# EAGLE schematic gforce2 (EAGLE 7.1.0)
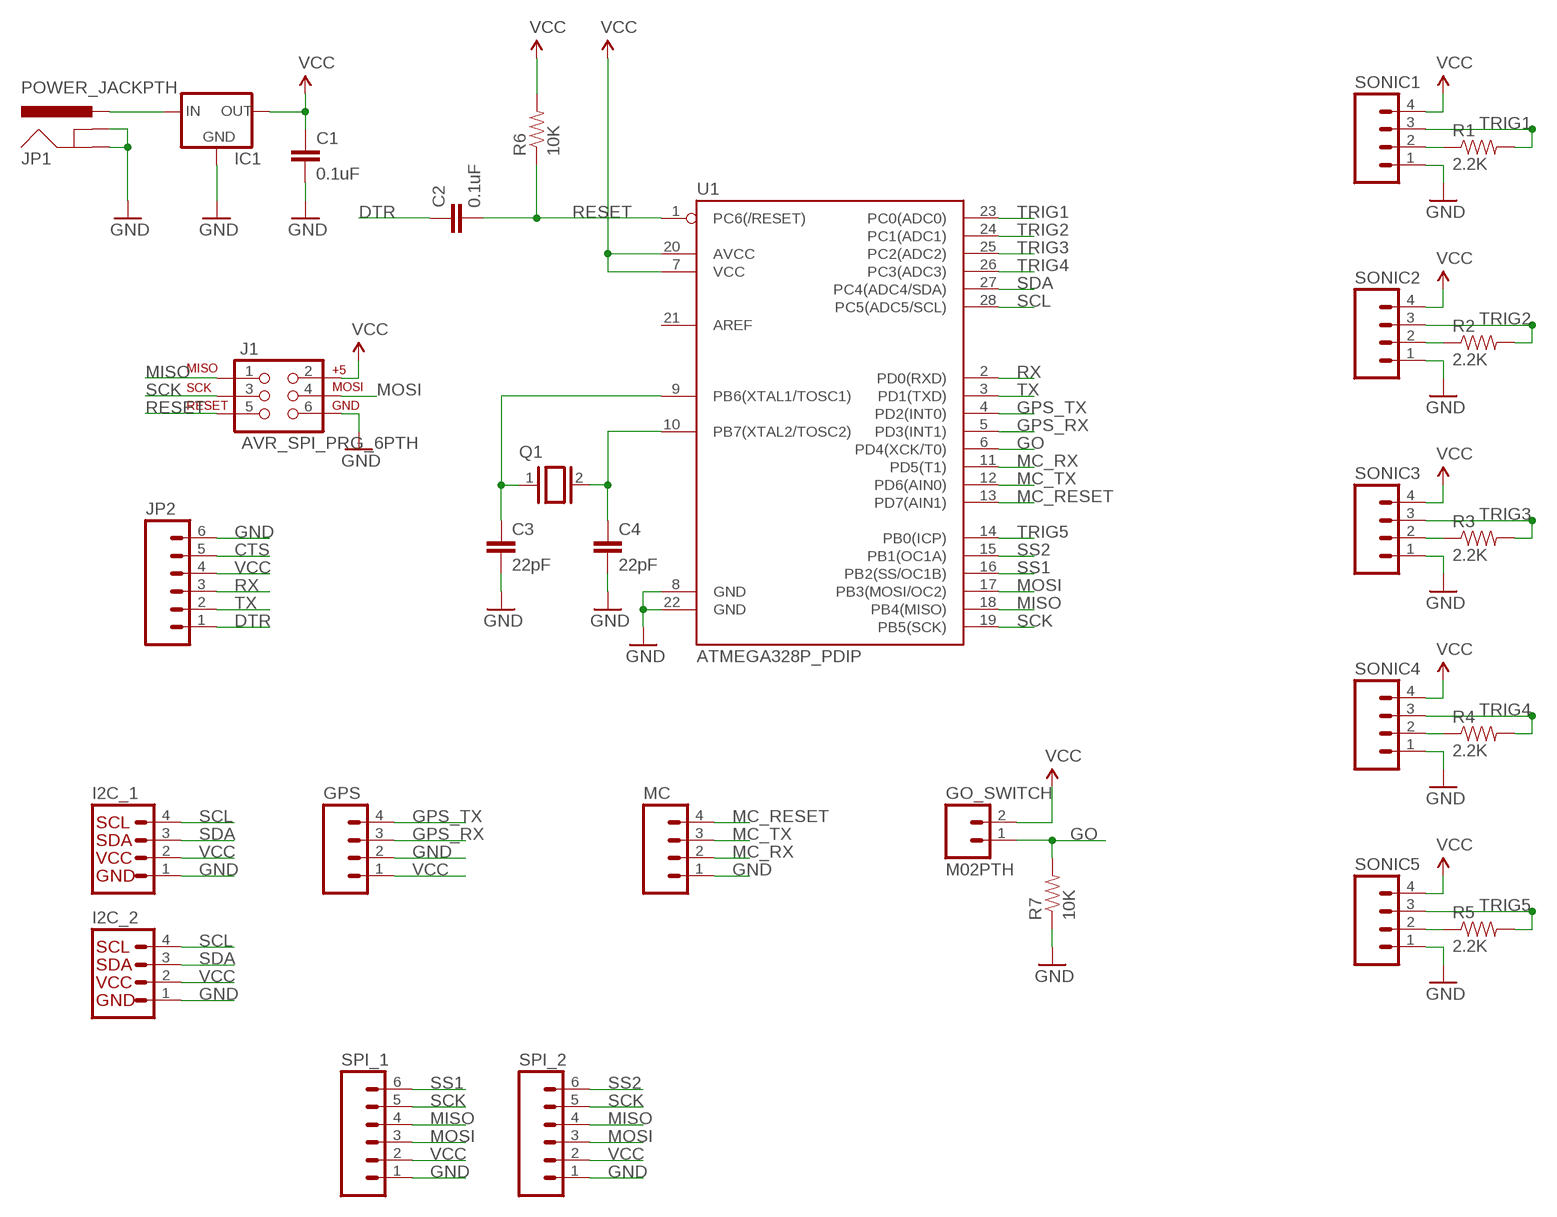
[diagram p0: schematic, sheet 1]

## Parts
C1  0.1uF  CAPPTH  [CAP-PTH-SMALL]
C2  0.1uF  CAPPTH  [CAP-PTH-SMALL]
C3  22pF  CAPPTH  [CAP-PTH-SMALL]
C4  22pF  CAPPTH  [CAP-PTH-SMALL]
GO_SWITCH  M02PTH  [1X02]
GPS  M04PTH  [1X04]
I2C_1  I2C_STANDARD  [1X04]
I2C_2  I2C_STANDARD  [1X04]
IC1  V_REG_78XXSIDE  [78XXL]
J1  AVR_SPI_PRG_6PTH  [2X3]
JP1  POWER_JACKPTH  [POWER_JACK_PTH]
JP2  M06SILK_FEMALE_PTH  [1X06]
MC  M04PTH  [1X04]
Q1  XTAL/S  [QS]
R1  2.2K  RESISTORPTH-1/4W  [AXIAL-0.4]
R2  2.2K  RESISTORPTH-1/4W  [AXIAL-0.4]
R3  2.2K  RESISTORPTH-1/4W  [AXIAL-0.4]
R4  2.2K  RESISTORPTH-1/4W  [AXIAL-0.4]
R5  2.2K  RESISTORPTH-1/4W  [AXIAL-0.4]
R6  10K  RESISTORPTH-1/4W  [AXIAL-0.4]
R7  10K  RESISTORPTH-1/4W  [AXIAL-0.4]
SONIC1  M04PTH  [1X04]
SONIC2  M04PTH  [1X04]
SONIC3  M04PTH  [1X04]
SONIC4  M04PTH  [1X04]
SONIC5  M04PTH  [1X04]
SPI_1  M06SILK_FEMALE_PTH  [1X06]
SPI_2  M06SILK_FEMALE_PTH  [1X06]
U1  ATMEGA328P_PDIP  [DIL28-3]

## Nets
CTS: JP2.5
DTR: C2.1 JP2.1
GND: C1.2 C3.2 C4.2 GPS.2 I2C_1.1 I2C_2.1 IC1.GND J1.6 JP1.GND JP1.GNDBREAK JP2.6 MC.1 R7.P$1 SONIC1.1 SONIC2.1 SONIC3.1 SONIC4.1 SONIC5.1 SPI_1.1 SPI_2.1 U1.8(GND) U1.22(GND)
GO: GO_SWITCH.1 R7.P$2 U1.6(PD4(XCK/T0))
GPS_RX: GPS.3 U1.5(PD3(INT1))
GPS_TX: GPS.4 U1.4(PD2(INT0))
MC_RESET: MC.4 U1.13(PD7(AIN1))
MC_RX: MC.2 U1.11(PD5(T1))
MC_TX: MC.3 U1.12(PD6(AIN0))
MISO: J1.1 SPI_1.4 SPI_2.4 U1.18(PB4(MISO))
MOSI: J1.4 SPI_1.3 SPI_2.3 U1.17(PB3(MOSI/OC2))
N$1: IC1.IN JP1.PWR
N$2: C3.1 Q1.1 U1.9(PB6(XTAL1/TOSC1))
N$3: R2.P$1 SONIC2.2
N$4: R1.P$1 SONIC1.2
N$5: R3.P$1 SONIC3.2
N$6: R4.P$1 SONIC4.2
N$7: R5.P$1 SONIC5.2
N$8: C4.1 Q1.2 U1.10(PB7(XTAL2/TOSC2))
RESET: C2.2 J1.5 R6.P$1 U1.1(PC6(/RESET))
RX: JP2.3 U1.2(PD0(RXD))
SCK: J1.3 SPI_1.5 SPI_2.5 U1.19(PB5(SCK))
SCL: I2C_1.4 I2C_2.4 U1.28(PC5(ADC5/SCL))
SDA: I2C_1.3 I2C_2.3 U1.27(PC4(ADC4/SDA))
SS1: SPI_1.6 U1.16(PB2(SS/OC1B))
SS2: SPI_2.6 U1.15(PB1(OC1A))
TRIG1: R1.P$2 SONIC1.3 U1.23(PC0(ADC0))
TRIG2: R2.P$2 SONIC2.3 U1.24(PC1(ADC1))
TRIG3: R3.P$2 SONIC3.3 U1.25(PC2(ADC2))
TRIG4: R4.P$2 SONIC4.3 U1.26(PC3(ADC3))
TRIG5: R5.P$2 SONIC5.3 U1.14(PB0(ICP))
TX: JP2.2 U1.3(PD1(TXD))
VCC: C1.1 GO_SWITCH.2 GPS.1 I2C_1.2 I2C_2.2 IC1.OUT J1.2 JP2.4 R6.P$2 SONIC1.4 SONIC2.4 SONIC3.4 SONIC4.4 SONIC5.4 SPI_1.2 SPI_2.2 U1.7(VCC) U1.20(AVCC)
Unconnected: U1.21(AREF)

## Library data of the parts
C1 C2 = SparkFun-Capacitors:CAP: Capacitor Standard 0603 ceramic capacitor, and 0.1" leaded capacitor.
C3 C4 = SparkFun-Passives:CAP: Capacitor Standard 0603 ceramic capacitor, and 0.1" leaded capacitor.
GO_SWITCH = SparkFun-Connectors:M02: Standard 2-pin 0.1" header. Use with - straight break away headers ( PRT-00116) - right angle break away headers (PRT-00553) - swiss pins (PRT-00743) - machine pins (PRT-00117) - female headers (PRT-00115) Molex polarized connector foot print use with: PRT-08233 with associated crimp pins and housings. 2.54_SCREWTERM for use with PRT-10571. 3.5mm Screw Terminal footprints for PRT-08084 5mm Screw Terminal footprints for use with PRT-08432
GPS MC SONIC1-SONIC5 = SparkFun-Connectors:M04: Header 4 Standard 4-pin 0.1" header. Use with straight break away headers (SKU : PRT-00116), right angle break away headers (PRT-00553), swiss pins (PRT-00743), machine pins (PRT-00117), and female headers (PRT-00115). Molex polarized connector foot print use with SKU : PRT-08231 with associated crimp pins and housings. 1MM SMD Version SKU: PRT-10208
I2C_1 I2C_2 = SparkFun-Connectors:I2C_STANDARD: SparkFun has standardized on a pinout for all I2C based sensor breakouts. This pinout allows I2C boards to be plugged directly into the headers on Arduino Uno compatible boards, and to be daisy chained easily.
IC1 = SparkFun-PowerIC:V_REG_78XX: Voltage Regulator Standard 7805 5V regulator. IGO (Input Ground Output). Spark Fun Electronics SKU : COM-00107
J1 = SparkFun-Connectors:AVR_SPI_PRG_6: AVR ISP 6 Pin This is the reduced ISP connector for AVR programming. Common on Arduino. This footprint will take up less PCB space and can be used with a 10-pin to 6-pin adapter such as SKU: BOB-08508 **Special note about "TEST_POINT" package. The stop mask is on the top side, so if you want your programming test points to be on the bottom of your board, make sure to place this package on the bottom side of the board. This also ensure that the orientation to program from the bottom side will be correct.
JP1 = SparkFun-Connectors:POWER_JACK: Power Jack This is the standard 5.5mm barrel jack for power. The PTH is the most common, proven, reliable, footprint. The Slot footprint only works if the mill layer is transmitted to the PCB fab house so be warned. Mating wall wart : TOL-00298 (and others); PROD_ID: CONN-08197
JP2 SPI_1 SPI_2 = SparkFun-Connectors:M06: Header 6 Standard 6-pin 0.1" header. Use with straight break away headers (SKU : PRT-00116), right angle break away headers (PRT-00553), swiss pins (PRT-00743), machine pins (PRT-00117), and female headers (PRT-00115). Molex polarized connector foot print use with SKU : PRT-08094 with associated crimp pins and housings. NOTES ON THE VARIANTS LOCK and LOCK_LONGPADS... This footprint was designed to help hold the alignment of a through-hole component (i.e. 6-pin header) while soldering it into place. You may notice that each hole has been shifted either up or down by 0.005 of an inch from it's more standard position (which is a perfectly straight line). This slight alteration caused the pins (the squares in the middle) to touch the edges of the holes. Because they are alternating, it causes a "brace" to hold the component in place. 0.005 has proven to be the perfect amount of "off-center" position when using our standard breakaway headers. Although looks a little odd when you look at the bare footprint, once you have a header in there, the alteration is very hard to notice. Also,if you push a header all the way into place, it is covered up entirely on the bottom side. This idea of altering the position of holes to aid alignment will be further integrated into the Sparkfun Library for other footprints. It can help hold any component with 3 or more connection pins.; PROD_ID: CONN-08437
Q1 = special:XTAL/S: CRYSTAL
R1-R7 = SparkFun-Passives:RESISTOR: Resistor Basic schematic elements and footprints for 0603, 1206, and PTH resistors.
U1 = SparkFun-DigitalIC:ATMEGA328P_PDIP: uC used in the Arduino 32kb flash, 1k EEPROM, 2k SRAM This is the through-hole version of this chip.